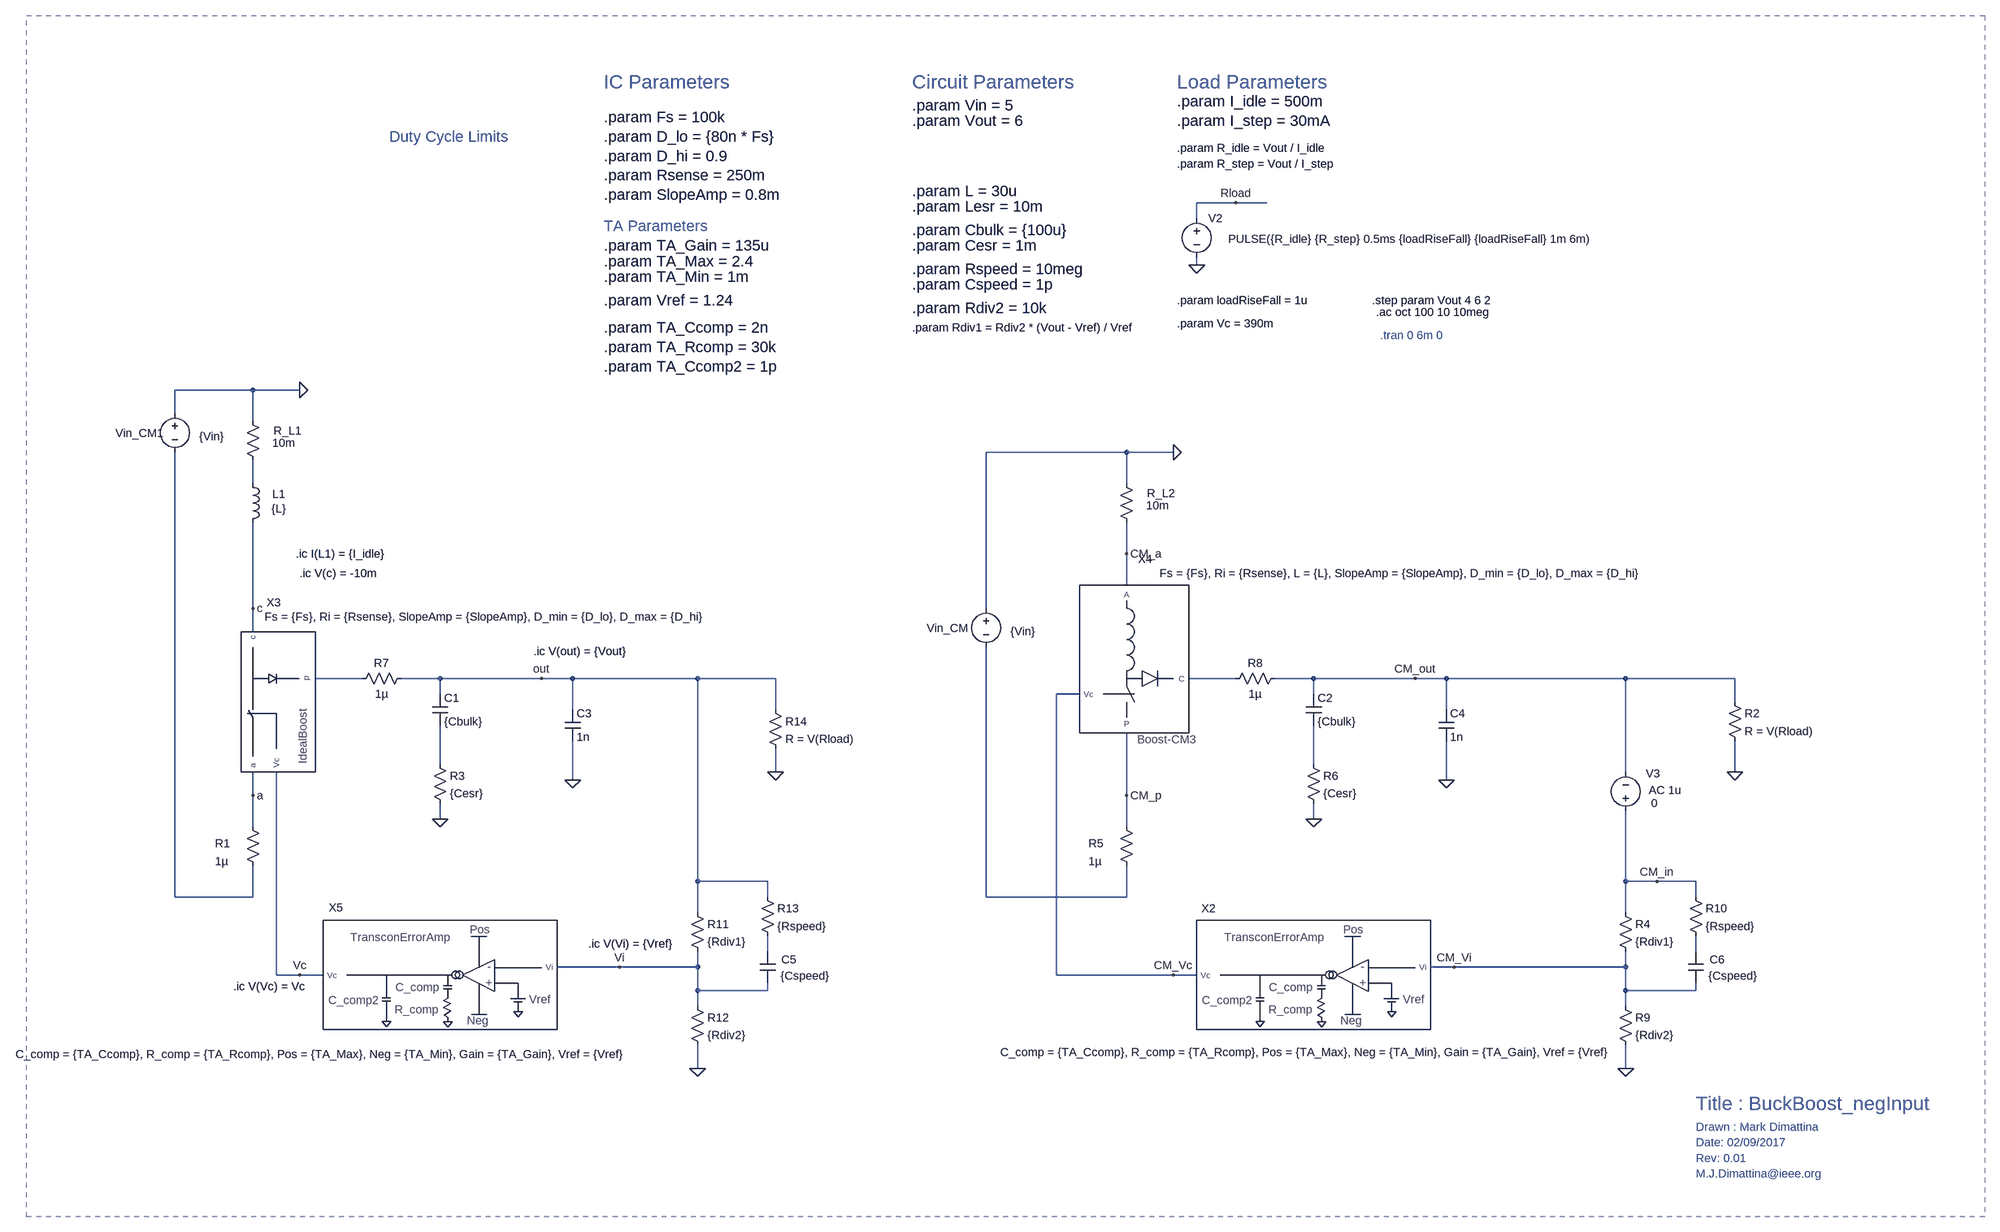
[diagram p0: schematic BuckBoost_negInput.asc]
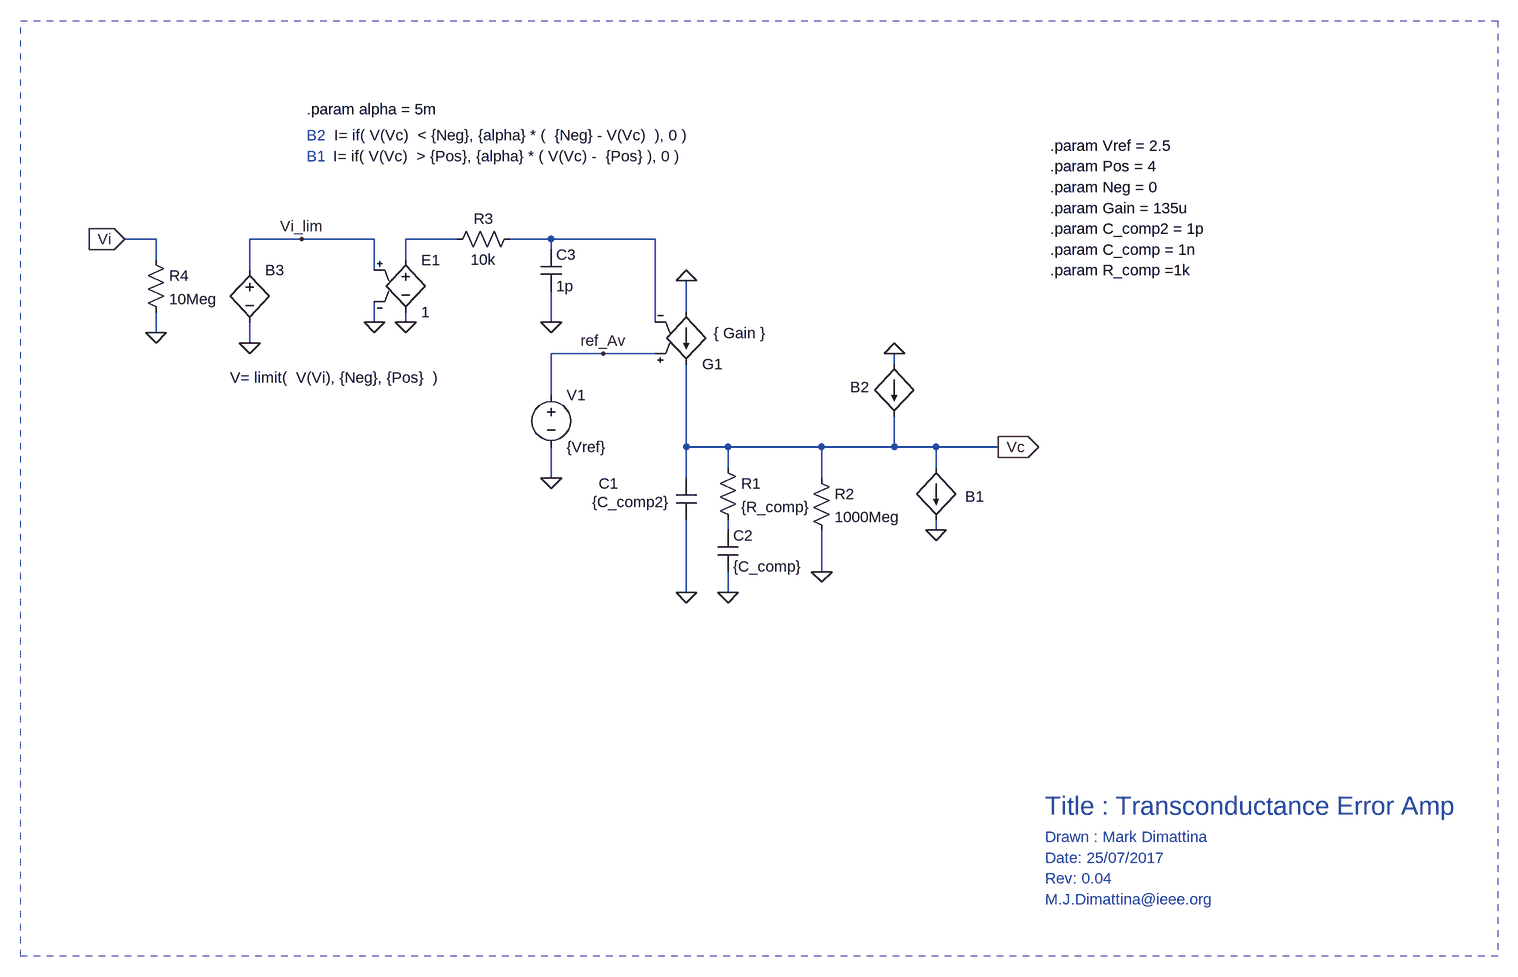
[diagram p1: sub-circuit transconerroramp.asc]
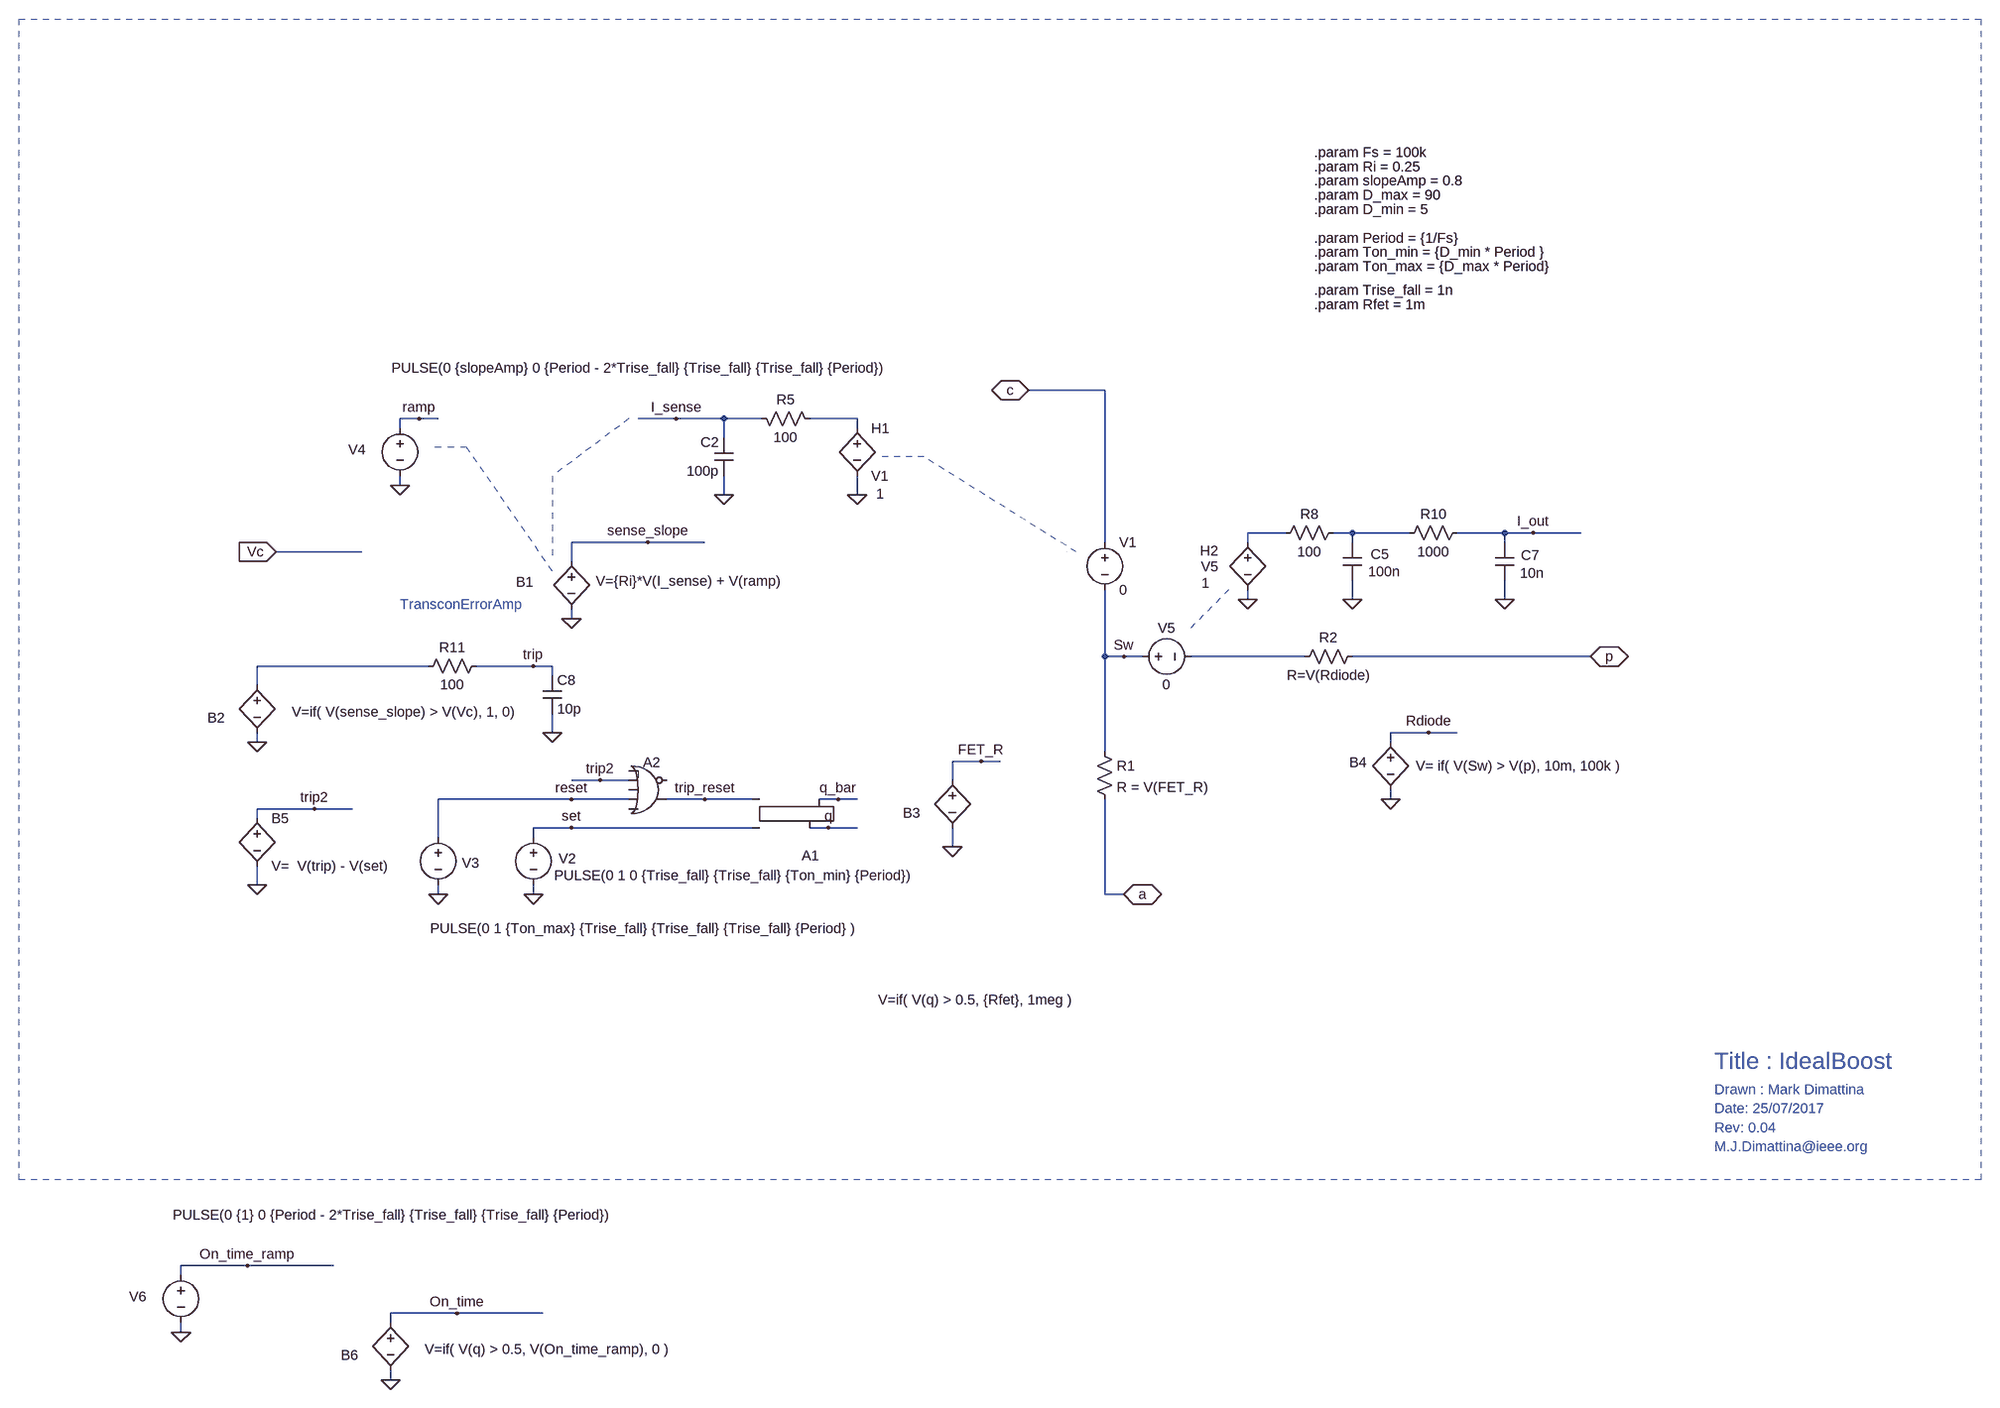
[diagram p2: sub-circuit idealboost.asc]
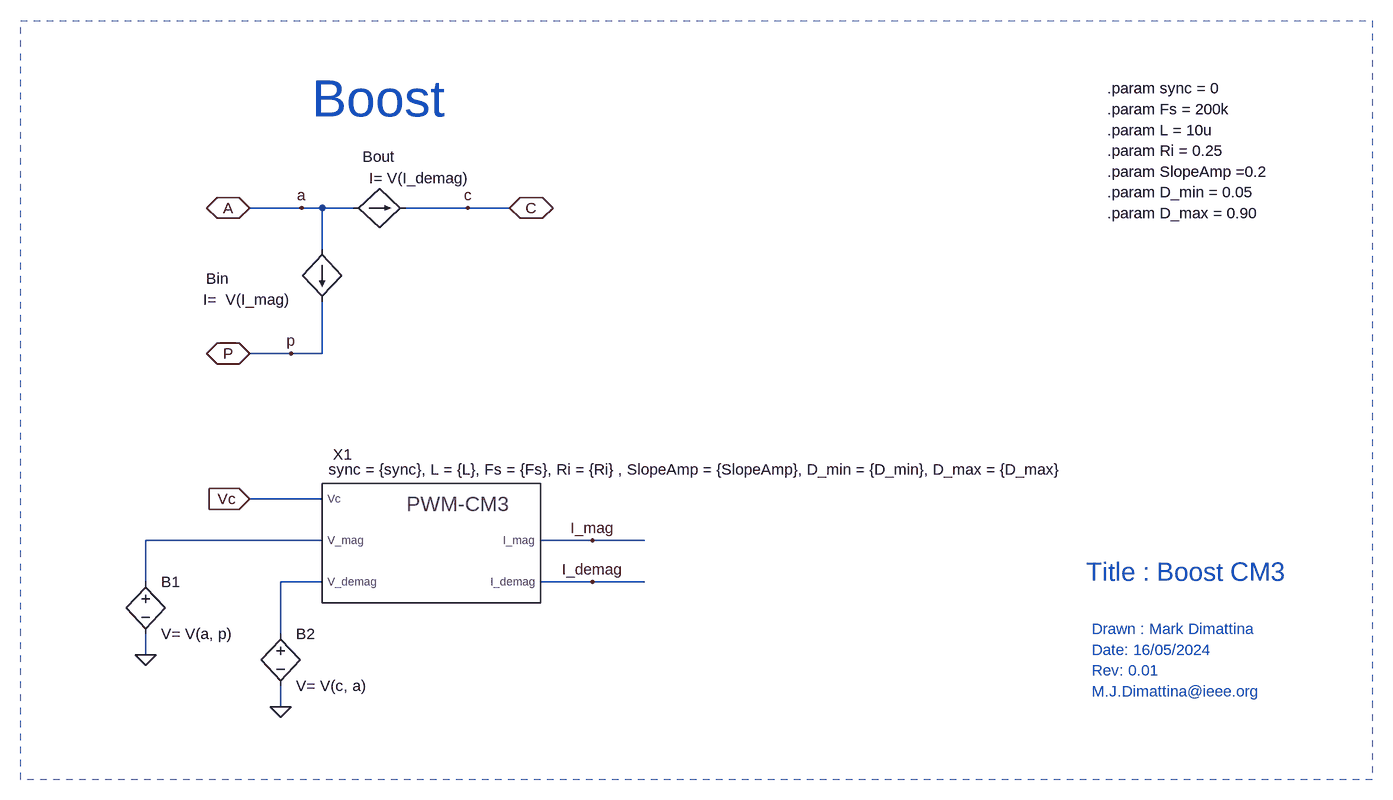
[diagram p3: sub-circuit boost_cm3.asc]
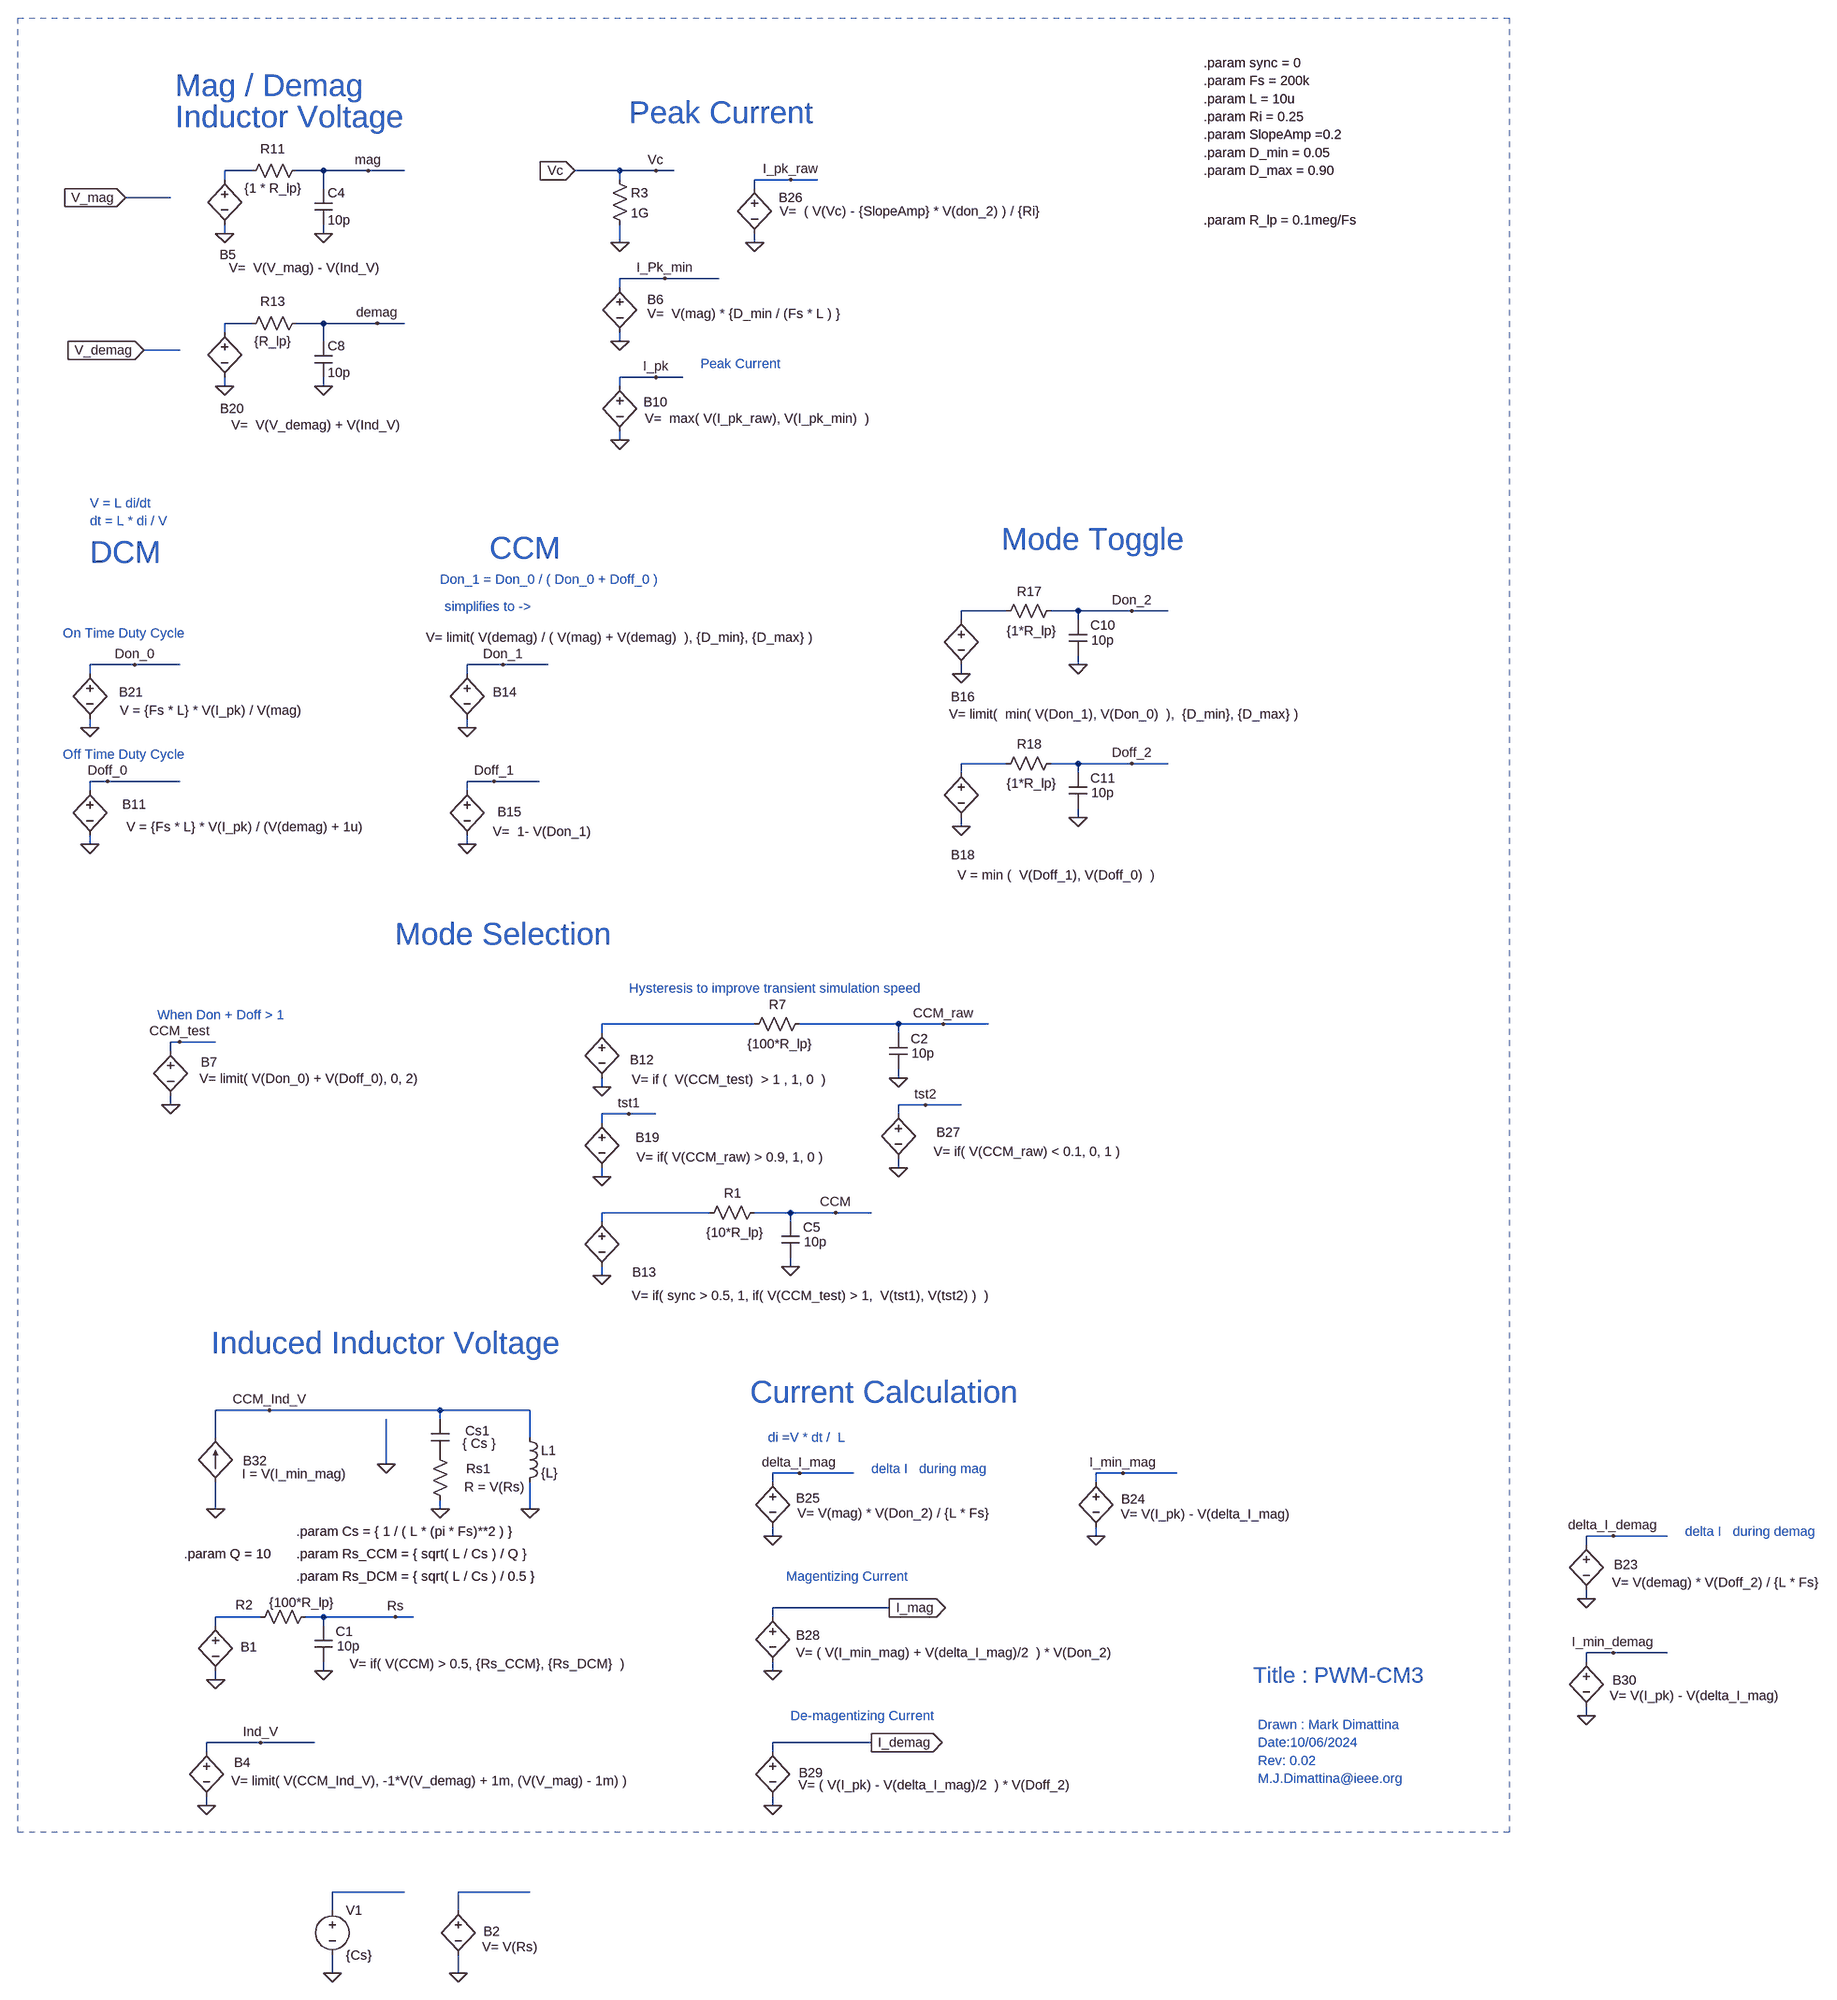
[diagram p4: sub-circuit pwm_cm3.asc]
BuckBoost_negInput.asc, the LTspice schematic file:
Version 4
SHEET 1 4164 4132
WIRE 784 -416 704 -416
WIRE 848 -416 784 -416
WIRE 704 -384 704 -416
WIRE 704 -288 704 -304
WIRE -1232 -32 -1392 -32
WIRE -1136 -32 -1232 -32
WIRE -1392 16 -1392 -32
WIRE -1232 32 -1232 -32
WIRE 560 96 272 96
WIRE 656 96 560 96
WIRE -1232 160 -1232 112
WIRE 560 160 560 96
WIRE 560 304 560 240
WIRE 560 368 560 304
WIRE -1232 416 -1232 240
WIRE 272 416 272 96
WIRE -1232 464 -1232 416
WIRE -1008 560 -1104 560
WIRE -848 560 -928 560
WIRE -640 560 -848 560
WIRE -576 560 -640 560
WIRE -320 560 -576 560
WIRE -160 560 -320 560
WIRE 784 560 688 560
WIRE 944 560 864 560
WIRE 1152 560 944 560
WIRE 1216 560 1152 560
WIRE 1584 560 1216 560
WIRE 1808 560 1584 560
WIRE -848 592 -848 560
WIRE 464 592 416 592
WIRE 944 592 944 560
WIRE 1808 608 1808 560
WIRE -576 624 -576 560
WIRE -160 624 -160 560
WIRE 1216 624 1216 560
WIRE -848 736 -848 656
WIRE 944 736 944 656
WIRE -160 752 -160 704
WIRE 1584 752 1584 560
WIRE 1808 752 1808 688
WIRE -576 768 -576 688
WIRE 1216 768 1216 688
WIRE -1232 800 -1232 752
WIRE 560 800 560 672
WIRE -848 848 -848 816
WIRE 944 848 944 816
WIRE -1232 864 -1232 800
WIRE 560 864 560 800
WIRE -320 976 -320 560
WIRE -176 976 -320 976
WIRE 1584 976 1584 832
WIRE 1648 976 1584 976
WIRE 1728 976 1648 976
WIRE -1392 1008 -1392 96
WIRE -1232 1008 -1232 944
WIRE -1232 1008 -1392 1008
WIRE -176 1008 -176 976
WIRE 272 1008 272 496
WIRE 560 1008 560 944
WIRE 560 1008 272 1008
WIRE 1728 1008 1728 976
WIRE -320 1040 -320 976
WIRE 1584 1040 1584 976
WIRE -176 1120 -176 1088
WIRE 1728 1120 1728 1088
WIRE -480 1152 -608 1152
WIRE -320 1152 -320 1120
WIRE -320 1152 -480 1152
WIRE 1232 1152 1184 1152
WIRE 1584 1152 1584 1120
WIRE 1584 1152 1232 1152
WIRE -1184 1168 -1184 752
WIRE -1136 1168 -1184 1168
WIRE -1088 1168 -1136 1168
WIRE 416 1168 416 592
WIRE 656 1168 416 1168
WIRE 704 1168 656 1168
WIRE -320 1200 -320 1152
WIRE -176 1200 -176 1184
WIRE -176 1200 -320 1200
WIRE 1584 1200 1584 1152
WIRE 1728 1200 1728 1184
WIRE 1728 1200 1584 1200
WIRE -320 1232 -320 1200
WIRE 1584 1232 1584 1200
WIRE -320 1360 -320 1312
WIRE 1584 1360 1584 1312
FLAG 1152 560 CM_out
FLAG 656 1168 CM_Vc
FLAG 944 848 0
FLAG 560 800 CM_p
FLAG 560 304 CM_a
FLAG 1216 768 0
FLAG 1584 1360 0
FLAG 1648 976 CM_in
FLAG 704 -288 0
FLAG 784 -416 Rload
FLAG 1808 752 0
FLAG 1232 1152 CM_Vi
FLAG -640 560 out
FLAG -1136 1168 Vc
FLAG -848 848 0
FLAG -1232 800 a
FLAG -1232 416 c
FLAG -576 768 0
FLAG -320 1360 0
FLAG -160 752 0
FLAG -480 1152 Vi
FLAG -1136 -32 0
FLAG 656 96 0
DATAFLAG 496 1168 ""
DATAFLAG 1712 560 ""
DATAFLAG 448 1008 ""
SYMBOL res 544 848 R0
WINDOW 0 -62 50 Left 2
WINDOW 3 -62 87 Left 2
SYMATTR InstName R5
SYMATTR Value 1µ
SYMBOL res 544 144 R0
WINDOW 0 58 36 Left 2
WINDOW 3 56 61 Left 2
SYMATTR InstName R_L2
SYMATTR Value 10m
SYMBOL voltage 272 400 R0
WINDOW 0 -122 57 Left 2
WINDOW 3 50 63 Left 2
SYMATTR InstName Vin_CM
SYMATTR Value {Vin}
SYMBOL cap 928 592 R0
SYMATTR InstName C2
SYMATTR Value {Cbulk}
SYMBOL res 928 720 R0
SYMATTR InstName R6
SYMATTR Value {Cesr}
SYMBOL res 768 576 R270
WINDOW 0 32 56 VTop 2
WINDOW 3 0 56 VBottom 2
SYMATTR InstName R8
SYMATTR Value 1µ
SYMBOL cap 1200 624 R0
SYMATTR InstName C4
SYMATTR Value 1n
SYMBOL res 1568 1024 R0
SYMATTR InstName R4
SYMATTR Value {Rdiv1}
SYMBOL res 1568 1216 R0
SYMATTR InstName R9
SYMATTR Value {Rdiv2}
SYMBOL res 1712 992 R0
SYMATTR InstName R10
SYMATTR Value {Rspeed}
SYMBOL cap 1712 1120 R0
WINDOW 0 44 17 Left 2
WINDOW 3 42 50 Left 2
SYMATTR InstName C6
SYMATTR Value {Cspeed}
SYMBOL voltage 1584 848 R180
WINDOW 0 -71 93 Left 2
WINDOW 3 -66 32 Left 2
WINDOW 123 -114 59 Left 2
WINDOW 39 0 0 Left 2
SYMATTR InstName V3
SYMATTR Value 0
SYMATTR Value2 AC 1u
SYMBOL voltage 704 -400 R0
WINDOW 3 65 58 Left 2
WINDOW 123 0 0 Left 2
WINDOW 39 0 0 Left 2
SYMATTR Value PULSE({R_idle} {R_step} 0.5ms {loadRiseFall} {loadRiseFall} 1m 6m)
SYMATTR InstName V2
SYMBOL res 1792 592 R0
SYMATTR InstName R2
SYMATTR Value R = V(Rload)
SYMBOL TransconErrorAmp 1088 1088 M0
WINDOW 0 345 -56 Left 2
WINDOW 39 -461 239 Left 2
SYMATTR InstName X2
SYMATTR SpiceLine C_comp = {TA_Ccomp}, R_comp = {TA_Rcomp}, Pos = {TA_Max}, Neg = {TA_Min}, Gain = {TA_Gain}, Vref = {Vref}
SYMBOL res -1248 848 R0
WINDOW 0 -62 50 Left 2
WINDOW 3 -62 87 Left 2
SYMATTR InstName R1
SYMATTR Value 1µ
SYMBOL ind -1248 144 R0
WINDOW 0 56 38 Left 2
WINDOW 3 54 68 Left 2
SYMATTR InstName L1
SYMATTR Value {L}
SYMBOL res -1248 16 R0
WINDOW 0 58 36 Left 2
WINDOW 3 56 61 Left 2
SYMATTR InstName R_L1
SYMATTR Value 10m
SYMBOL voltage -1392 0 R0
WINDOW 0 -122 57 Left 2
WINDOW 3 50 63 Left 2
SYMATTR InstName Vin_CM1
SYMATTR Value {Vin}
SYMBOL cap -864 592 R0
SYMATTR InstName C1
SYMATTR Value {Cbulk}
SYMBOL res -864 720 R0
SYMATTR InstName R3
SYMATTR Value {Cesr}
SYMBOL res -1024 576 R270
WINDOW 0 32 56 VTop 2
WINDOW 3 0 56 VBottom 2
SYMATTR InstName R7
SYMATTR Value 1µ
SYMBOL cap -592 624 R0
SYMATTR InstName C3
SYMATTR Value 1n
SYMBOL res -336 1024 R0
SYMATTR InstName R11
SYMATTR Value {Rdiv1}
SYMBOL res -336 1216 R0
SYMATTR InstName R12
SYMATTR Value {Rdiv2}
SYMBOL res -192 992 R0
SYMATTR InstName R13
SYMATTR Value {Rspeed}
SYMBOL cap -192 1120 R0
WINDOW 0 44 17 Left 2
WINDOW 3 42 50 Left 2
SYMATTR InstName C5
SYMATTR Value {Cspeed}
SYMBOL res -176 608 R0
SYMATTR InstName R14
SYMATTR Value R = V(Rload)
SYMBOL TransconErrorAmp -704 1088 M0
WINDOW 0 343 -58 Left 2
WINDOW 39 -233 243 Left 2
SYMATTR InstName X5
SYMATTR SpiceLine C_comp = {TA_Ccomp}, R_comp = {TA_Rcomp}, Pos = {TA_Max}, Neg = {TA_Min}, Gain = {TA_Gain}, Vref = {Vref}
SYMBOL IdealBoost -1200 656 R270
WINDOW 39 223 -8 VRight 2
WINDOW 0 236 11 VTop 2
SYMATTR SpiceLine Fs = {Fs}, Ri = {Rsense}, SlopeAmp = {SlopeAmp}, D_min = {D_lo}, D_max = {D_hi}
SYMATTR InstName X3
SYMBOL Boost_CM3 496 448 R0
WINDOW 0 102 -117 Bottom 2
WINDOW 39 625 -88 Bottom 2
SYMATTR InstName X4
SYMATTR SpiceLine Fs = {Fs}, Ri = {Rsense}, L = {L}, SlopeAmp = {SlopeAmp}, D_min = {D_lo}, D_max = {D_hi}
TEXT 1072 -192 Left 2 !.ac oct 100 10 10meg
TEXT 120 -440 Left 3 !.param L = 30u
TEXT -512 -592 Left 3 !.param Fs = 100k
TEXT -512 -552 Left 3 !.param D_lo = {80n * Fs}
TEXT -512 -512 Left 3 !.param D_hi = 0.9
TEXT -512 -432 Left 3 !.param SlopeAmp = 0.8m
TEXT -704 -552 Right 3 ;Duty Cycle Limits
TEXT -512 -664 Left 4 ;IC Parameters
TEXT 120 -584 Left 3 !.param Vout = 6
TEXT 120 -360 Left 3 !.param Cbulk = {100u}
TEXT 120 -328 Left 3 !.param Cesr = 1m
TEXT 120 -616 Left 3 !.param Vin = 5
TEXT 120 -408 Left 3 !.param Lesr = 10m
TEXT -512 -472 Left 3 !.param Rsense = 250m
TEXT 120 -200 Left 3 !.param Rdiv2 = 10k
TEXT 120 -160 Left 2 !.param Rdiv1 = Rdiv2 * (Vout - Vref) / Vref
TEXT -512 -216 Left 3 !.param Vref = 1.24
TEXT -512 -368 Left 3 ;TA Parameters
TEXT -512 -120 Left 3 !.param TA_Rcomp = 30k
TEXT -512 -160 Left 3 !.param TA_Ccomp = 2n
TEXT -512 -80 Left 3 !.param TA_Ccomp2 = 1p
TEXT -512 -328 Left 3 !.param TA_Gain = 135u
TEXT -512 -296 Left 3 !.param TA_Max = 2.4
TEXT -512 -264 Left 3 !.param TA_Min = 1m
TEXT 664 -584 Left 3 !.param I_step = 30mA
TEXT 664 -624 Left 3 !.param I_idle = 500m
TEXT 664 -528 Left 2 !.param R_idle = Vout / I_idle
TEXT 664 -216 Left 2 !.param loadRiseFall = 1u
TEXT 120 -280 Left 3 !.param Rspeed = 10meg
TEXT 120 -248 Left 3 !.param Cspeed = 1p
TEXT 664 -168 Left 2 !.param Vc = 390m
TEXT 120 -664 Left 4 ;Circuit Parameters
TEXT 664 -496 Left 2 !.param R_step = Vout / I_step
TEXT -656 504 Left 2 !.ic V(out) = {Vout}
TEXT -544 1104 Left 2 !.ic V(Vi) = {Vref}
TEXT 664 -664 Left 4 ;Load Parameters
TEXT -1272 1192 Left 2 !.ic V(Vc) = Vc
TEXT -1144 304 Left 2 !.ic I(L1) = {I_idle}
TEXT 1728 1480 Left 2 ;Drawn : Mark Dimattina
TEXT 1728 1432 Left 4 ;Title : BuckBoost_negInput
TEXT 1728 1544 Left 2 ;Rev: 0.01
TEXT 1728 1512 Left 2 ;Date: 02/09/2017
TEXT 1728 1576 Left 2 ;M.J.Dimattina@ieee.org
TEXT 1080 -144 Left 2 ;.tran 0 6m 0
TEXT -1136 344 Left 2 !.ic V(c) = -10m
TEXT 1064 -216 Left 2 !.step param Vout 4 6 2
RECTANGLE Normal 2320 1664 -1696 -800 2

transconerroramp.asc, the sub-circuit schematic file:
Version 4
SHEET 1 1752 1300
WIRE -560 192 -608 192
WIRE -336 192 -416 192
WIRE -224 192 -336 192
WIRE -96 192 -176 192
WIRE 48 192 -16 192
WIRE 208 192 48 192
WIRE 48 208 48 192
WIRE -560 224 -560 192
WIRE -176 224 -176 192
WIRE -416 240 -416 192
WIRE -224 240 -224 192
WIRE 256 304 256 256
WIRE -224 320 -224 288
WIRE -176 320 -176 304
WIRE 48 320 48 272
WIRE 208 320 208 192
WIRE -560 336 -560 304
WIRE -416 352 -416 320
WIRE 128 368 48 368
WIRE 208 368 128 368
WIRE 576 384 576 368
WIRE 48 432 48 368
WIRE 256 512 256 384
WIRE 320 512 256 512
WIRE 464 512 320 512
WIRE 576 512 576 464
WIRE 576 512 464 512
WIRE 640 512 576 512
WIRE 736 512 640 512
WIRE 320 544 320 512
WIRE 640 544 640 512
WIRE 48 560 48 512
WIRE 256 560 256 512
WIRE 464 560 464 512
WIRE 320 640 320 624
WIRE 640 640 640 624
WIRE 464 704 464 640
WIRE 256 736 256 624
WIRE 320 736 320 704
FLAG 48 560 0
FLAG 256 256 0
FLAG 256 736 0
FLAG 320 736 0
FLAG 128 368 ref_Av
FLAG -608 192 Vi
IOPIN -608 192 In
FLAG 736 512 Vc
IOPIN 736 512 Out
FLAG 640 640 0
FLAG 576 368 0
FLAG 464 704 0
FLAG -176 320 0
FLAG -224 320 0
FLAG 48 320 0
FLAG -416 352 0
FLAG -336 192 Vi_lim
FLAG -560 336 0
SYMBOL g 256 400 M180
WINDOW 3 42 63 Left 2
SYMATTR Value { Gain }
SYMATTR InstName G1
SYMBOL voltage 48 416 R0
SYMATTR InstName V1
SYMATTR Value {Vref}
SYMBOL cap 240 560 R0
WINDOW 3 -129 37 Left 2
WINDOW 0 -119 8 Left 2
SYMATTR Value {C_comp2}
SYMATTR InstName C1
SYMBOL cap 304 640 R0
SYMATTR InstName C2
SYMATTR Value {C_comp}
SYMBOL res 304 528 R0
SYMATTR InstName R1
SYMATTR Value {R_comp}
SYMBOL bi 640 544 R0
WINDOW 3 -927 -480 Left 2
WINDOW 0 45 44 Left 2
SYMATTR Value I= if( V(Vc)  > {Pos}, {alpha} * ( V(Vc) -  {Pos} ), 0 )
SYMATTR InstName B1
SYMBOL bi 576 384 R0
WINDOW 0 -68 36 Left 2
WINDOW 3 -862 -352 Left 2
SYMATTR InstName B2
SYMATTR Value I= if( V(Vc)  < {Neg}, {alpha} * (  {Neg} - V(Vc)  ), 0 )
SYMBOL res 448 544 R0
SYMATTR InstName R2
SYMATTR Value 1000Meg
SYMBOL cap 32 208 R0
SYMATTR InstName C3
SYMATTR Value 1p
SYMBOL res 0 176 R90
WINDOW 0 0 56 VBottom 2
WINDOW 3 32 56 VTop 2
SYMATTR InstName R3
SYMATTR Value 10k
SYMBOL e -176 208 R0
SYMATTR InstName E1
SYMATTR Value 1
SYMBOL bv -416 224 R0
WINDOW 3 -30 181 Left 2
SYMATTR Value V= limit(  V(Vi), {Neg}, {Pos}  )
SYMATTR InstName B3
SYMBOL res -576 208 R0
SYMATTR InstName R4
SYMATTR Value 10Meg
TEXT -328 -8 Left 2 !.param alpha = 5m
TEXT 816 240 Left 2 !.param R_comp =1k
TEXT 816 208 Left 2 !.param C_comp = 1n
TEXT 816 176 Left 2 !.param C_comp2 = 1p
TEXT -328 64 Left 2 ;B1
TEXT -328 32 Left 2 ;B2
TEXT 808 1112 Left 2 ;Drawn : Mark Dimattina
TEXT 808 1064 Left 4 ;Title : Transconductance Error Amp
TEXT 808 1176 Left 2 ;Rev: 0.04
TEXT 808 1144 Left 2 ;Date: 25/07/2017
TEXT 808 1208 Left 2 ;M.J.Dimattina@ieee.org
TEXT 816 80 Left 2 !.param Pos = 4
TEXT 816 112 Left 2 !.param Neg = 0
TEXT 816 48 Left 2 !.param Vref = 2.5
TEXT 816 144 Left 2 !.param Gain = 135u
RECTANGLE Normal 1504 1296 -768 -144 2

idealboost.asc, the sub-circuit schematic file:
Version 4
SHEET 1 972 680
WIRE -912 -1456 -1040 -1456
WIRE -2064 -1408 -2096 -1408
WIRE -2032 -1408 -2064 -1408
WIRE -1632 -1408 -1696 -1408
WIRE -1552 -1408 -1632 -1408
WIRE -1488 -1408 -1552 -1408
WIRE -1328 -1408 -1408 -1408
WIRE -2096 -1392 -2096 -1408
WIRE -1328 -1392 -1328 -1408
WIRE -1552 -1376 -1552 -1408
WIRE -2096 -1296 -2096 -1312
WIRE -1552 -1280 -1552 -1312
WIRE -1328 -1280 -1328 -1312
WIRE -608 -1216 -672 -1216
WIRE -496 -1216 -528 -1216
WIRE -400 -1216 -496 -1216
WIRE -240 -1216 -320 -1216
WIRE -192 -1216 -240 -1216
WIRE -112 -1216 -192 -1216
WIRE -1680 -1200 -1808 -1200
WIRE -1584 -1200 -1680 -1200
WIRE -912 -1200 -912 -1456
WIRE -672 -1200 -672 -1216
WIRE -496 -1200 -496 -1216
WIRE -240 -1200 -240 -1216
WIRE -2160 -1184 -2304 -1184
WIRE -1808 -1168 -1808 -1200
WIRE -672 -1104 -672 -1120
WIRE -496 -1104 -496 -1136
WIRE -240 -1104 -240 -1136
WIRE -1808 -1072 -1808 -1088
WIRE -912 -1008 -912 -1120
WIRE -880 -1008 -912 -1008
WIRE -848 -1008 -880 -1008
WIRE -576 -1008 -768 -1008
WIRE -96 -1008 -496 -1008
WIRE -2048 -992 -2336 -992
WIRE -1872 -992 -1968 -992
WIRE -1840 -992 -1872 -992
WIRE -1840 -976 -1840 -992
WIRE -2336 -960 -2336 -992
WIRE -1840 -880 -1840 -912
WIRE -368 -880 -432 -880
WIRE -320 -880 -368 -880
WIRE -2336 -864 -2336 -880
WIRE -432 -864 -432 -880
WIRE -912 -848 -912 -1008
WIRE -1120 -832 -1168 -832
WIRE -1088 -832 -1120 -832
WIRE -1760 -800 -1808 -800
WIRE -1712 -800 -1760 -800
WIRE -1168 -800 -1168 -832
WIRE -1808 -768 -2032 -768
WIRE -1712 -768 -1808 -768
WIRE -1584 -768 -1648 -768
WIRE -1504 -768 -1584 -768
WIRE -1360 -768 -1392 -768
WIRE -1328 -768 -1360 -768
WIRE -432 -768 -432 -784
WIRE -2240 -752 -2336 -752
WIRE -2176 -752 -2240 -752
WIRE -2336 -736 -2336 -752
WIRE -1808 -720 -1872 -720
WIRE -1504 -720 -1808 -720
WIRE -1376 -720 -1408 -720
WIRE -1328 -720 -1376 -720
WIRE -2032 -704 -2032 -768
WIRE -1872 -704 -1872 -720
WIRE -1168 -688 -1168 -720
WIRE -2336 -624 -2336 -656
WIRE -2032 -608 -2032 -624
WIRE -1872 -608 -1872 -624
WIRE -912 -608 -912 -768
WIRE -880 -608 -912 -608
WIRE -2352 16 -2464 16
WIRE -2208 16 -2352 16
WIRE -2464 32 -2464 16
WIRE -2000 96 -2112 96
WIRE -1856 96 -2000 96
WIRE -2112 112 -2112 96
WIRE -2464 128 -2464 112
WIRE -2112 208 -2112 192
FLAG -1040 -1456 c
IOPIN -1040 -1456 BiDir
FLAG -1328 -1280 0
FLAG -1632 -1408 I_sense
FLAG -1552 -1280 0
FLAG -1872 -608 0
FLAG -2032 -608 0
FLAG -1808 -768 reset
FLAG -1808 -720 set
FLAG -1584 -768 trip_reset
FLAG -96 -1008 p
IOPIN -96 -1008 BiDir
FLAG -1376 -720 q
FLAG -672 -1104 0
FLAG -496 -1104 0
FLAG -880 -608 a
IOPIN -880 -608 BiDir
FLAG -880 -1008 Sw
FLAG -1680 -1200 sense_slope
FLAG -192 -1216 I_out
FLAG -240 -1104 0
FLAG -2304 -1184 Vc
IOPIN -2304 -1184 In
FLAG -1360 -768 q_bar
FLAG -2336 -864 0
FLAG -1840 -880 0
FLAG -1872 -992 trip
FLAG -1760 -800 trip2
FLAG -1168 -688 0
FLAG -2096 -1296 0
FLAG -2064 -1408 ramp
FLAG -1808 -1072 0
FLAG -432 -768 0
FLAG -368 -880 Rdiode
FLAG -2336 -624 0
FLAG -2240 -752 trip2
FLAG -2464 128 0
FLAG -2352 16 On_time_ramp
FLAG -2112 208 0
FLAG -2000 96 On_time
FLAG -1120 -832 FET_R
SYMBOL h -1328 -1408 R0
WINDOW 123 32 126 Left 2
SYMATTR Value2 1
SYMATTR InstName H1
SYMATTR Value V1
SYMBOL voltage -912 -1216 R0
SYMATTR InstName V1
SYMATTR Value 0
SYMBOL res -1504 -1424 M90
WINDOW 0 0 56 VBottom 2
WINDOW 3 32 56 VTop 2
SYMATTR InstName R5
SYMATTR Value 100
SYMBOL cap -1536 -1376 M0
SYMATTR InstName C2
SYMATTR Value 100p
SYMBOL srflop -1456 -672 M180
WINDOW 0 35 1 Left 2
SYMATTR InstName A1
SYMBOL voltage -1872 -720 M0
WINDOW 3 -35 80 Right 2
WINDOW 123 0 0 Left 2
WINDOW 39 0 0 Left 2
WINDOW 0 -72 52 Left 2
SYMATTR Value PULSE(0 1 0 {Trise_fall} {Trise_fall} {Ton_min} {Period})
SYMATTR InstName V2
SYMBOL voltage -2032 -720 R0
WINDOW 123 0 0 Left 2
WINDOW 39 0 0 Left 2
WINDOW 3 -13 169 Left 2
WINDOW 0 40 59 Left 2
SYMATTR Value PULSE(0 1 {Ton_max} {Trise_fall} {Trise_fall} {Trise_fall} {Period} )
SYMATTR InstName V3
SYMBOL h -672 -1216 R0
WINDOW 123 -77 84 Left 2
WINDOW 0 -80 30 Left 2
WINDOW 3 -78 57 Left 2
SYMATTR Value2 1
SYMATTR InstName H2
SYMATTR Value V5
SYMBOL res -512 -1232 R90
WINDOW 0 0 56 VBottom 2
WINDOW 3 32 56 VTop 2
SYMATTR InstName R8
SYMATTR Value 100
SYMBOL cap -512 -1200 R0
WINDOW 0 47 20 Left 2
WINDOW 3 43 49 Left 2
SYMATTR InstName C5
SYMATTR Value 100n
SYMBOL voltage -2096 -1408 R0
WINDOW 3 -14 -85 Left 2
WINDOW 123 0 0 Left 2
WINDOW 39 0 0 Left 2
WINDOW 0 -87 52 Left 2
SYMATTR Value PULSE(0 {slopeAmp} 0 {Period - 2*Trise_fall} {Trise_fall} {Trise_fall} {Period})
SYMATTR InstName V4
SYMBOL bv -1808 -1184 R0
WINDOW 0 -93 51 Left 2
WINDOW 3 41 49 Left 2
SYMATTR InstName B1
SYMATTR Value V={Ri}*V(I_sense) + V(ramp)
SYMBOL voltage -864 -1008 R270
WINDOW 0 32 56 VTop 2
WINDOW 3 -32 56 VBottom 2
SYMATTR InstName V5
SYMATTR Value 0
SYMBOL res -304 -1232 R90
WINDOW 0 0 56 VBottom 2
WINDOW 3 32 56 VTop 2
SYMATTR InstName R10
SYMATTR Value 1000
SYMBOL cap -256 -1200 R0
WINDOW 0 43 22 Left 2
WINDOW 3 42 52 Left 2
SYMATTR InstName C7
SYMATTR Value 10n
SYMBOL Digital\\or -1680 -720 M180
WINDOW 0 -8 110 Left 2
SYMATTR InstName A2
SYMBOL bv -2336 -976 R0
WINDOW 0 -83 71 Left 2
WINDOW 3 58 61 Left 2
SYMATTR InstName B2
SYMATTR Value V=if( V(sense_slope) > V(Vc), 1, 0)
SYMBOL res -1952 -1008 R90
WINDOW 0 0 56 VBottom 2
WINDOW 3 32 56 VTop 2
SYMATTR InstName R11
SYMATTR Value 100
SYMBOL cap -1856 -976 R0
SYMATTR InstName C8
SYMATTR Value 10p
SYMBOL bv -1168 -816 R0
WINDOW 0 -83 71 Left 2
WINDOW 3 -125 385 Left 2
SYMATTR InstName B3
SYMATTR Value V=if( V(q) > 0.5, {Rfet}, 1meg )
SYMBOL res -592 -992 R270
WINDOW 0 32 56 VTop 2
WINDOW 3 0 56 VBottom 2
SYMATTR InstName R2
SYMATTR Value R=V(Rdiode)
SYMBOL bv -432 -880 R0
WINDOW 0 -69 50 Left 2
WINDOW 3 43 56 Left 2
SYMATTR InstName B4
SYMATTR Value V= if( V(Sw) > V(p), 10m, 100k )
SYMBOL bv -2336 -752 R0
SYMATTR InstName B5
SYMATTR Value V=  V(trip) - V(set)
SYMBOL voltage -2464 16 R0
WINDOW 3 -14 -85 Left 2
WINDOW 123 0 0 Left 2
WINDOW 39 0 0 Left 2
WINDOW 0 -87 52 Left 2
SYMATTR Value PULSE(0 {1} 0 {Period - 2*Trise_fall} {Trise_fall} {Trise_fall} {Period})
SYMATTR InstName V6
SYMBOL bv -2112 96 R0
WINDOW 0 -83 71 Left 2
WINDOW 3 58 61 Left 2
SYMATTR InstName B6
SYMATTR Value V=if( V(q) > 0.5, V(On_time_ramp), 0 )
SYMBOL res -928 -864 R0
SYMATTR InstName R1
SYMATTR Value R = V(FET_R)
TEXT -2096 -1096 Left 2 ;TransconErrorAmp
TEXT -560 -1712 Left 2 !.param Period = {1/Fs}
TEXT -560 -1624 Left 2 !.param Trise_fall = 1n
TEXT -560 -1688 Left 2 !.param Ton_min = {D_min * Period }
TEXT -560 -1664 Left 2 !.param Ton_max = {D_max * Period}
TEXT -560 -1600 Left 2 !.param Rfet = 1m
TEXT -560 -1856 Left 2 !.param Fs = 100k
TEXT -560 -1784 Left 2 !.param D_max = 90
TEXT -560 -1760 Left 2 !.param D_min = 5
TEXT -560 -1808 Left 2 !.param slopeAmp = 0.8
TEXT -560 -1832 Left 2 !.param Ri = 0.25
TEXT 112 -280 Left 2 ;Drawn : Mark Dimattina
TEXT 112 -328 Left 4 ;Title : IdealBoost
TEXT 112 -216 Left 2 ;Rev: 0.04
TEXT 112 -248 Left 2 ;Date: 25/07/2017
TEXT 112 -184 Left 2 ;M.J.Dimattina@ieee.org
LINE Normal -1216 -1344 -1296 -1344 2
LINE Normal -960 -1184 -1216 -1344 2
LINE Normal -976 -1184 -976 -1184 2
LINE Normal -704 -1120 -768 -1056 2
LINE Normal -1840 -1312 -1840 -1168 2
LINE Normal -1712 -1408 -1840 -1312 2
LINE Normal -1984 -1360 -2048 -1360 2
LINE Normal -1840 -1152 -1984 -1360 2
RECTANGLE Normal 560 -128 -2736 -2080 2

boost_cm3.asc, the sub-circuit schematic file:
Version 4
SHEET 1 3748 852
WIRE -1872 -2448 -1952 -2448
WIRE -1840 -2448 -1872 -2448
WIRE -1792 -2448 -1840 -2448
WIRE -1616 -2448 -1712 -2448
WIRE -1552 -2448 -1616 -2448
WIRE -1840 -2384 -1840 -2448
WIRE -1888 -2224 -1952 -2224
WIRE -1840 -2224 -1840 -2304
WIRE -1840 -2224 -1888 -2224
WIRE -1840 -2000 -1952 -2000
WIRE -1840 -1936 -2112 -1936
WIRE -1424 -1936 -1504 -1936
WIRE -1344 -1936 -1424 -1936
WIRE -2112 -1872 -2112 -1936
WIRE -1840 -1872 -1904 -1872
WIRE -1424 -1872 -1504 -1872
WIRE -1344 -1872 -1424 -1872
WIRE -1904 -1792 -1904 -1872
WIRE -2112 -1760 -2112 -1792
WIRE -1904 -1680 -1904 -1712
FLAG -1952 -2448 A
IOPIN -1952 -2448 BiDir
FLAG -1552 -2448 C
IOPIN -1552 -2448 BiDir
FLAG -1952 -2224 P
IOPIN -1952 -2224 BiDir
FLAG -1616 -2448 c
FLAG -1872 -2448 a
FLAG -1952 -2000 Vc
IOPIN -1952 -2000 In
FLAG -2112 -1760 0
FLAG -1904 -1680 0
FLAG -1424 -1936 I_mag
FLAG -1424 -1872 I_demag
FLAG -1888 -2224 p
SYMBOL bi -1840 -2384 R0
WINDOW 0 -179 45 Left 2
WINDOW 3 -183 77 Left 2
SYMATTR InstName Bin
SYMATTR Value I=  V(I_mag)
SYMBOL bi -1792 -2448 R270
WINDOW 0 63 39 VTop 2
WINDOW 3 61 101 VBottom 2
SYMATTR InstName Bout
SYMATTR Value I= V(I_demag)
SYMBOL PWM_CM3 -1680 -1936 R0
WINDOW 0 -129 -117 Bottom 2
WINDOW 39 -150 -109 Left 2
SYMATTR InstName X1
SYMATTR SpiceLine sync = {sync}, L = {L}, Fs = {Fs}, Ri = {Ri} , SlopeAmp = {SlopeAmp}, D_min = {D_min}, D_max = {D_max}
SYMBOL bv -2112 -1888 R0
SYMATTR InstName B1
SYMATTR Value V= V(a, p)
SYMBOL bv -1904 -1808 R0
SYMATTR InstName B2
SYMATTR Value V= V(c, a)
TEXT -632 -2568 Left 2 !.param L = 10u
TEXT -632 -2600 Left 2 !.param Fs = 200k
TEXT -632 -2472 Left 2 !.param D_min = 0.05
TEXT -632 -2440 Left 2 !.param D_max = 0.90
TEXT -632 -2504 Left 2 !.param SlopeAmp =0.2
TEXT -632 -2536 Left 2 !.param Ri = 0.25
TEXT -632 -2632 Left 2 !.param sync = 0
TEXT -656 -1800 Left 2 ;Drawn : Mark Dimattina
TEXT -664 -1888 Left 4 ;Title : Boost CM3
TEXT -656 -1736 Left 2 ;Rev: 0.01
TEXT -656 -1768 Left 2 ;Date: 16/05/2024
TEXT -656 -1704 Left 2 ;M.J.Dimattina@ieee.org
TEXT -1856 -2616 Left 6 ;Boost
RECTANGLE Normal -224 -1568 -2304 -2736 2

pwm_cm3.asc, the sub-circuit schematic file:
Version 4
SHEET 1 4220 852
WIRE -1600 -4432 -1648 -4432
WIRE -1472 -4432 -1520 -4432
WIRE -1392 -4432 -1472 -4432
WIRE -1328 -4432 -1392 -4432
WIRE -944 -4432 -1024 -4432
WIRE -880 -4432 -944 -4432
WIRE -848 -4432 -880 -4432
WIRE -1648 -4416 -1648 -4432
WIRE -944 -4416 -944 -4432
WIRE -640 -4416 -704 -4416
WIRE -592 -4416 -640 -4416
WIRE -1472 -4400 -1472 -4432
WIRE -704 -4400 -704 -4416
WIRE -1744 -4384 -1824 -4384
WIRE -1648 -4320 -1648 -4336
WIRE -1472 -4320 -1472 -4336
WIRE -944 -4304 -944 -4336
WIRE -704 -4304 -704 -4320
WIRE -864 -4240 -944 -4240
WIRE -768 -4240 -864 -4240
WIRE -944 -4224 -944 -4240
WIRE -1600 -4160 -1648 -4160
WIRE -1472 -4160 -1520 -4160
WIRE -1376 -4160 -1472 -4160
WIRE -1328 -4160 -1376 -4160
WIRE -1648 -4144 -1648 -4160
WIRE -1472 -4128 -1472 -4160
WIRE -944 -4128 -944 -4144
WIRE -1728 -4112 -1792 -4112
WIRE -880 -4064 -944 -4064
WIRE -832 -4064 -880 -4064
WIRE -1648 -4048 -1648 -4064
WIRE -1472 -4048 -1472 -4064
WIRE -944 -4048 -944 -4064
WIRE -944 -3952 -944 -3968
WIRE -256 -3648 -336 -3648
WIRE -128 -3648 -176 -3648
WIRE -32 -3648 -128 -3648
WIRE 32 -3648 -32 -3648
WIRE -336 -3632 -336 -3648
WIRE -128 -3632 -128 -3648
WIRE -1808 -3552 -1888 -3552
WIRE -1728 -3552 -1808 -3552
WIRE -1152 -3552 -1216 -3552
WIRE -1072 -3552 -1152 -3552
WIRE -128 -3552 -128 -3568
WIRE -1888 -3536 -1888 -3552
WIRE -1216 -3536 -1216 -3552
WIRE -336 -3536 -336 -3552
WIRE -1888 -3440 -1888 -3456
WIRE -1216 -3440 -1216 -3456
WIRE -256 -3376 -336 -3376
WIRE -128 -3376 -176 -3376
WIRE -32 -3376 -128 -3376
WIRE 32 -3376 -32 -3376
WIRE -336 -3360 -336 -3376
WIRE -128 -3360 -128 -3376
WIRE -1856 -3344 -1888 -3344
WIRE -1728 -3344 -1856 -3344
WIRE -1168 -3344 -1216 -3344
WIRE -1088 -3344 -1168 -3344
WIRE -1888 -3328 -1888 -3344
WIRE -1216 -3328 -1216 -3344
WIRE -128 -3280 -128 -3296
WIRE -336 -3264 -336 -3280
WIRE -1888 -3232 -1888 -3248
WIRE -1216 -3232 -1216 -3248
WIRE -704 -2912 -976 -2912
WIRE -448 -2912 -624 -2912
WIRE -368 -2912 -448 -2912
WIRE -288 -2912 -368 -2912
WIRE -976 -2896 -976 -2912
WIRE -448 -2896 -448 -2912
WIRE -1728 -2880 -1744 -2880
WIRE -1664 -2880 -1728 -2880
WIRE -1744 -2864 -1744 -2880
WIRE -448 -2816 -448 -2832
WIRE -976 -2800 -976 -2816
WIRE -1744 -2768 -1744 -2784
WIRE -400 -2768 -448 -2768
WIRE -336 -2768 -400 -2768
WIRE -928 -2752 -976 -2752
WIRE -880 -2752 -928 -2752
WIRE -448 -2752 -448 -2768
WIRE -976 -2736 -976 -2752
WIRE -448 -2656 -448 -2672
WIRE -976 -2640 -976 -2656
WIRE -784 -2576 -976 -2576
WIRE -640 -2576 -704 -2576
WIRE -560 -2576 -640 -2576
WIRE -496 -2576 -560 -2576
WIRE -976 -2560 -976 -2576
WIRE -640 -2560 -640 -2576
WIRE -640 -2480 -640 -2496
WIRE -976 -2464 -976 -2480
WIRE -1568 -2224 -1664 -2224
WIRE -1264 -2224 -1568 -2224
WIRE -1104 -2224 -1264 -2224
WIRE -1264 -2208 -1264 -2224
WIRE -1664 -2176 -1664 -2224
WIRE -1104 -2176 -1104 -2224
WIRE -1360 -2128 -1360 -2208
WIRE -624 -2112 -672 -2112
WIRE -528 -2112 -624 -2112
WIRE -48 -2112 -96 -2112
WIRE 48 -2112 -48 -2112
WIRE -672 -2096 -672 -2112
WIRE -96 -2096 -96 -2112
WIRE -1664 -2048 -1664 -2096
WIRE -1264 -2048 -1264 -2064
WIRE -1104 -2048 -1104 -2096
WIRE -672 -2000 -672 -2016
WIRE -96 -2000 -96 -2016
WIRE 832 -2000 784 -2000
WIRE 928 -2000 832 -2000
WIRE 784 -1984 784 -2000
WIRE 784 -1888 784 -1904
WIRE -464 -1872 -672 -1872
WIRE -1584 -1856 -1664 -1856
WIRE -1472 -1856 -1504 -1856
WIRE -1344 -1856 -1472 -1856
WIRE -1312 -1856 -1344 -1856
WIRE -672 -1856 -672 -1872
WIRE -1664 -1840 -1664 -1856
WIRE -1472 -1840 -1472 -1856
WIRE 832 -1792 784 -1792
WIRE 928 -1792 832 -1792
WIRE 784 -1776 784 -1792
WIRE -1472 -1760 -1472 -1776
WIRE -672 -1760 -672 -1776
WIRE -1664 -1744 -1664 -1760
WIRE 784 -1680 784 -1696
WIRE -1584 -1632 -1680 -1632
WIRE -1488 -1632 -1584 -1632
WIRE -496 -1632 -672 -1632
WIRE -1680 -1616 -1680 -1632
WIRE -672 -1616 -672 -1632
WIRE -1680 -1520 -1680 -1536
WIRE -672 -1520 -672 -1536
WIRE -1328 -1312 -1456 -1312
WIRE -1104 -1312 -1232 -1312
WIRE -1456 -1280 -1456 -1312
WIRE -1232 -1280 -1232 -1312
WIRE -1456 -1168 -1456 -1200
WIRE -1232 -1168 -1232 -1200
FLAG -944 -4304 0
FLAG -1024 -4432 Vc
IOPIN -1024 -4432 In
FLAG -880 -4432 Vc
FLAG -880 -4064 I_pk
FLAG -944 -4128 0
FLAG -864 -4240 I_Pk_min
FLAG -944 -3952 0
FLAG -704 -4304 0
FLAG -640 -4416 I_pk_raw
FLAG -1888 -3440 0
FLAG -1808 -3552 Don_0
FLAG -1888 -3232 0
FLAG -976 -2800 0
FLAG -560 -2576 CCM
FLAG -448 -2816 0
FLAG -1216 -3440 0
FLAG -1216 -3232 0
FLAG -1168 -3344 Doff_1
FLAG -336 -3536 0
FLAG -32 -3648 Don_2
FLAG -128 -3552 0
FLAG -336 -3264 0
FLAG -32 -3376 Doff_2
FLAG -128 -3280 0
FLAG 784 -1888 0
FLAG 832 -2000 delta_I_demag
FLAG -96 -2000 0
FLAG -48 -2112 I_min_mag
FLAG -672 -2000 0
FLAG -624 -2112 delta_I_mag
FLAG -672 -1760 0
FLAG -464 -1872 I_mag
IOPIN -464 -1872 Out
FLAG -672 -1520 0
FLAG -496 -1632 I_demag
IOPIN -496 -1632 Out
FLAG 784 -1680 0
FLAG 832 -1792 I_min_demag
FLAG -1856 -3344 Doff_0
FLAG -1568 -2224 CCM_Ind_V
FLAG -1648 -4320 0
FLAG -1392 -4432 mag
FLAG -1472 -4320 0
FLAG -1456 -1168 0
FLAG -368 -2912 CCM_raw
FLAG -1152 -3552 Don_1
FLAG -1680 -1520 0
FLAG -1584 -1632 Ind_V
FLAG -1648 -4048 0
FLAG -1376 -4160 demag
FLAG -1472 -4048 0
FLAG -1744 -2768 0
FLAG -1728 -2880 CCM_test
FLAG -976 -2464 0
FLAG -928 -2752 tst1
FLAG -976 -2640 0
FLAG -400 -2768 tst2
FLAG -448 -2656 0
FLAG -640 -2480 0
FLAG -1664 -2048 0
FLAG -1264 -2048 0
FLAG -1104 -2048 0
FLAG -1824 -4384 V_mag
IOPIN -1824 -4384 In
FLAG -1792 -4112 V_demag
IOPIN -1792 -4112 In
FLAG -1232 -1168 0
FLAG -1360 -2128 0
FLAG -1664 -1744 0
FLAG -1344 -1856 Rs
FLAG -1472 -1760 0
DATAFLAG -1376 -1312 ""
DATAFLAG -1152 -1312 ""
SYMBOL res -960 -4432 R0
SYMATTR InstName R3
SYMATTR Value 1G
SYMBOL bv -944 -4240 R0
WINDOW 3 49 63 Left 2
WINDOW 0 49 38 Left 2
SYMATTR Value V=  V(mag) * {D_min / (Fs * L ) }
SYMATTR InstName B6
SYMBOL bv -944 -4064 R0
WINDOW 3 45 73 Left 2
WINDOW 0 42 44 Left 2
SYMATTR Value V=  max( V(I_pk_raw), V(I_pk_min)  )
SYMATTR InstName B10
SYMBOL bv -704 -4416 R0
WINDOW 3 45 56 Left 2
WINDOW 0 43 32 Left 2
SYMATTR Value V=  ( V(Vc) - {SlopeAmp} * V(don_2) ) / {Ri}
SYMATTR InstName B26
SYMBOL bv -1888 -3552 R0
WINDOW 3 54 81 Left 2
WINDOW 0 52 49 Left 2
SYMATTR Value V = {Fs * L} * V(I_pk) / V(mag)
SYMATTR InstName B21
SYMBOL bv -1888 -3344 R0
WINDOW 3 65 81 Left 2
WINDOW 0 58 41 Left 2
SYMATTR Value V = {Fs * L} * V(I_pk) / (V(demag) + 1u)
SYMATTR InstName B11
SYMBOL bv -976 -2912 R0
WINDOW 3 53 99 Left 2
WINDOW 0 50 64 Left 2
SYMATTR Value V= if (  V(CCM_test)  > 1 , 1, 0  )
SYMATTR InstName B12
SYMBOL res -608 -2928 R90
WINDOW 0 -3 55 VBottom 2
WINDOW 3 36 51 VTop 2
SYMATTR InstName R7
SYMATTR Value {100*R_lp}
SYMBOL cap -464 -2896 R0
WINDOW 0 38 10 Left 2
WINDOW 3 40 36 Left 2
SYMATTR InstName C2
SYMATTR Value 10p
SYMBOL bv -1216 -3552 R0
WINDOW 3 -73 -49 Left 2
WINDOW 0 46 49 Left 2
SYMATTR Value V= limit( V(demag) / ( V(mag) + V(demag)  ), {D_min}, {D_max} )
SYMATTR InstName B14
SYMBOL bv -1216 -3344 R0
WINDOW 3 221 89 Right 2
WINDOW 0 54 54 Left 2
SYMATTR Value V=  1- V(Don_1)
SYMATTR InstName B15
SYMBOL bv -336 -3648 R0
WINDOW 3 -22 184 Left 2
WINDOW 0 -18 153 Left 2
SYMATTR Value V= limit(  min( V(Don_1), V(Don_0)  ),  {D_min}, {D_max} )
SYMATTR InstName B16
SYMBOL res -160 -3664 R90
WINDOW 0 -3 55 VBottom 2
WINDOW 3 36 51 VTop 2
SYMATTR InstName R17
SYMATTR Value {1*R_lp}
SYMBOL cap -144 -3632 R0
WINDOW 0 38 10 Left 2
WINDOW 3 40 36 Left 2
SYMATTR InstName C10
SYMATTR Value 10p
SYMBOL bv -336 -3376 R0
WINDOW 3 -7 199 Left 2
WINDOW 0 -18 163 Left 2
SYMATTR Value V = min (  V(Doff_1), V(Doff_0)  )
SYMATTR InstName B18
SYMBOL res -160 -3392 R90
WINDOW 0 -3 55 VBottom 2
WINDOW 3 36 51 VTop 2
SYMATTR InstName R18
SYMATTR Value {1*R_lp}
SYMBOL cap -144 -3360 R0
WINDOW 0 38 10 Left 2
WINDOW 3 40 36 Left 2
SYMATTR InstName C11
SYMATTR Value 10p
SYMBOL bv 784 -2000 R0
WINDOW 3 46 83 Left 2
WINDOW 0 49 51 Left 2
SYMATTR Value V= V(demag) * V(Doff_2) / {L * Fs}
SYMATTR InstName B23
SYMBOL bv -96 -2112 R0
WINDOW 3 44 73 Left 2
WINDOW 0 45 46 Left 2
SYMATTR Value V= V(I_pk) - V(delta_I_mag)
SYMATTR InstName B24
SYMBOL bv -672 -2112 R0
WINDOW 3 44 71 Left 2
WINDOW 0 42 45 Left 2
SYMATTR Value V= V(mag) * V(Don_2) / {L * Fs}
SYMATTR InstName B25
SYMBOL bv -672 -1872 R0
WINDOW 3 42 80 Left 2
WINDOW 0 42 49 Left 2
SYMATTR Value V= ( V(I_min_mag) + V(delta_I_mag)/2  ) * V(Don_2)
SYMATTR InstName B28
SYMBOL bv -672 -1632 R0
WINDOW 3 46 76 Left 2
WINDOW 0 47 54 Left 2
SYMATTR Value V= ( V(I_pk) - V(delta_I_mag)/2  ) * V(Doff_2)
SYMATTR InstName B29
SYMBOL bv 784 -1792 R0
WINDOW 3 42 76 Left 2
WINDOW 0 47 49 Left 2
SYMATTR Value V= V(I_pk) - V(delta_I_mag)
SYMATTR InstName B30
SYMBOL cap -1280 -2208 R0
WINDOW 0 61 21 Left 2
WINDOW 3 56 43 Left 2
SYMATTR InstName Cs1
SYMATTR Value { Cs }
SYMBOL ind -1120 -2192 R0
SYMATTR InstName L1
SYMATTR Value {L}
SYMATTR SpiceLine Rser=0.1u
SYMBOL bv -1648 -4432 R0
WINDOW 3 277 173 Right 2
WINDOW 0 -9 150 Left 2
SYMATTR Value V=  V(V_mag) - V(Ind_V)
SYMATTR InstName B5
SYMBOL res -1504 -4448 R90
WINDOW 0 -7 58 VBottom 2
WINDOW 3 32 58 VTop 2
SYMATTR InstName R11
SYMATTR Value {1 * R_lp}
SYMBOL cap -1488 -4400 R0
SYMATTR InstName C4
SYMATTR Value 10p
SYMBOL voltage -1456 -1296 R0
SYMATTR InstName V1
SYMATTR Value {Cs}
SYMBOL bv -1680 -1632 R0
WINDOW 0 49 36 Left 2
WINDOW 3 44 68 Left 2
SYMATTR InstName B4
SYMATTR Value V= limit( V(CCM_Ind_V), -1*V(V_demag) + 1m, (V(V_mag) - 1m) )
SYMBOL bv -1648 -4160 R0
WINDOW 3 314 181 Right 2
WINDOW 0 -8 152 Left 2
SYMATTR Value V=  V(V_demag) + V(Ind_V)
SYMATTR InstName B20
SYMBOL res -1504 -4176 R90
WINDOW 0 -7 58 VBottom 2
WINDOW 3 32 58 VTop 2
SYMATTR InstName R13
SYMATTR Value {R_lp}
SYMBOL cap -1488 -4128 R0
SYMATTR InstName C8
SYMATTR Value 10p
SYMBOL bv -1744 -2880 R0
WINDOW 3 51 65 Left 2
WINDOW 0 54 36 Left 2
SYMATTR Value V= limit( V(Don_0) + V(Doff_0), 0, 2)
SYMATTR InstName B7
SYMBOL bv -976 -2576 R0
WINDOW 3 53 148 Left 2
WINDOW 0 54 106 Left 2
SYMATTR Value V= if( sync > 0.5, 1, if( V(CCM_test) > 1,  V(tst1), V(tst2) )  )
SYMATTR InstName B13
SYMBOL bv -976 -2752 R0
WINDOW 3 62 77 Left 2
WINDOW 0 60 42 Left 2
SYMATTR Value V= if( V(CCM_raw) > 0.9, 1, 0 )
SYMATTR InstName B19
SYMBOL bv -448 -2768 R0
WINDOW 3 63 83 Left 2
WINDOW 0 68 49 Left 2
SYMATTR Value V= if( V(CCM_raw) < 0.1, 0, 1 )
SYMATTR InstName B27
SYMBOL res -688 -2592 R90
WINDOW 0 -3 55 VBottom 2
WINDOW 3 36 51 VTop 2
SYMATTR InstName R1
SYMATTR Value {10*R_lp}
SYMBOL cap -656 -2560 R0
WINDOW 0 38 10 Left 2
WINDOW 3 40 36 Left 2
SYMATTR InstName C5
SYMATTR Value 10p
SYMBOL bi -1664 -2096 R180
WINDOW 0 -92 38 Left 2
WINDOW 3 -47 15 Right 2
SYMATTR InstName B32
SYMATTR Value I = V(I_min_mag)
SYMBOL res -1280 -2160 R0
WINDOW 0 62 40 Left 2
WINDOW 3 59 73 Left 2
SYMATTR InstName Rs1
SYMATTR Value R = V(Rs)
SYMBOL bv -1664 -1856 R0
WINDOW 0 45 54 Left 2
WINDOW 3 239 84 Left 2
SYMATTR InstName B1
SYMATTR Value V= if( V(CCM) > 0.5, {Rs_CCM}, {Rs_DCM}  )
SYMBOL bv -1232 -1296 R0
WINDOW 0 45 54 Left 2
WINDOW 3 43 81 Left 2
SYMATTR InstName B2
SYMATTR Value V= V(Rs)
SYMBOL res -1488 -1872 R90
WINDOW 0 10 125 VBottom 2
WINDOW 3 -25 23 VTop 2
SYMATTR InstName R2
SYMATTR Value {100*R_lp}
SYMBOL cap -1488 -1840 R0
WINDOW 0 38 10 Left 2
WINDOW 3 40 36 Left 2
SYMATTR InstName C1
SYMATTR Value 10p
TEXT 96 -4344 Left 2 !.param R_lp = 0.1meg/Fs
TEXT 96 -4560 Left 2 !.param L = 10u
TEXT 96 -4592 Left 2 !.param Fs = 200k
TEXT 96 -4464 Left 2 !.param D_min = 0.05
TEXT 96 -4432 Left 2 !.param D_max = 0.90
TEXT 96 -4496 Left 2 !.param SlopeAmp =0.2
TEXT 96 -4528 Left 2 !.param Ri = 0.25
TEXT 96 -4624 Left 2 !.param sync = 0
TEXT 192 -1664 Left 2 ;Drawn : Mark Dimattina
TEXT 184 -1752 Left 4 ;Title : PWM-CM3
TEXT 192 -1600 Left 2 ;Rev: 0.02
TEXT 192 -1632 Left 2 ;Date:10/06/2024
TEXT 192 -1568 Left 2 ;M.J.Dimattina@ieee.org
TEXT -1520 -2008 Left 2 !.param Cs = { 1 / ( L * (pi * Fs)**2 ) }
TEXT -800 -4088 Left 2 ;Peak Current
TEXT -1888 -3840 Left 2 ;V = L di/dt
TEXT -1888 -3808 Left 2 ;dt = L * di / V
TEXT 960 -2008 Left 2 ;delta I   during demag
TEXT -680 -2176 Left 2 ;di =V * dt /  L
TEXT -496 -2120 Left 2 ;delta I   during mag
TEXT -648 -1928 Left 2 ;Magentizing Current
TEXT -640 -1680 Left 2 ;De-magentizing Current
TEXT -1936 -3608 Left 2 ;On Time Duty Cycle
TEXT -1936 -3392 Left 2 ;Off Time Duty Cycle
TEXT -1768 -2928 Left 2 ;When Don + Doff > 1
TEXT -1264 -3704 Left 2 ;Don_1 = Don_0 / ( Don_0 + Doff_0 )
TEXT -1256 -3656 Left 2 ;simplifies to ->
TEXT -1888 -3752 Left 5 ;DCM
TEXT -1176 -3760 Left 5 ;CCM
TEXT -264 -3776 Left 5 ;Mode Toggle
TEXT -1344 -3072 Left 5 ;Mode Selection
TEXT -712 -2256 Left 5 ;Current Calculation
TEXT -1672 -2344 Left 5 ;Induced Inductor Voltage
TEXT -928 -4536 Left 5 ;Peak Current
TEXT -928 -2976 Left 2 ;Hysteresis to improve transient simulation speed
TEXT -1736 -4528 Left 5 ;Inductor Voltage
TEXT -1736 -4584 Left 5 ;Mag / Demag
TEXT -1520 -1968 Left 2 !.param Rs_CCM = { sqrt( L / Cs ) / Q }
TEXT -1720 -1968 Left 2 !.param Q = 10
TEXT -1520 -1928 Left 2 !.param Rs_DCM = { sqrt( L / Cs ) / 0.5 }
RECTANGLE Normal 640 -1472 -2016 -4704 2

The netlist it stands for:
* BuckBoost_negInput.asc
R5 CM_p N007 1µ
R_L2 0 CM_a 10m
Vin_CM 0 N007 {Vin}
C2 CM_out N005 {Cbulk}
R6 N005 0 {Cesr}
R8 N003 CM_out 1µ
C4 CM_out 0 1n
R4 CM_in CM_Vi {Rdiv1}
R9 CM_Vi 0 {Rdiv2}
R10 CM_in N009 {Rspeed}
C6 N009 CM_Vi {Cspeed}
V3 CM_in CM_out 0 AC 1u
V2 Rload 0 PULSE({R_idle} {R_step} 0.5ms {loadRiseFall} {loadRiseFall} 1m 6m)
R2 CM_out 0 R = V(Rload)
XX2 CM_Vi CM_Vc transconerroramp params: C_comp = {TA_Ccomp}, R_comp = {TA_Rcomp}, Pos = {TA_Max}, Neg = {TA_Min}, Gain = {TA_Gain}, Vref = {Vref}
R1 a N006 1µ
L1 N001 c {L}
R_L1 0 N001 10m
Vin_CM1 0 N006 {Vin}
C1 out N004 {Cbulk}
R3 N004 0 {Cesr}
R7 N002 out 1µ
C3 out 0 1n
R11 out Vi {Rdiv1}
R12 Vi 0 {Rdiv2}
R13 out N008 {Rspeed}
C5 N008 Vi {Cspeed}
R14 out 0 R = V(Rload)
XX5 Vi Vc transconerroramp params: C_comp = {TA_Ccomp}, R_comp = {TA_Rcomp}, Pos = {TA_Max}, Neg = {TA_Min}, Gain = {TA_Gain}, Vref = {Vref}
XX3 Vc a c N002 idealboost params: Fs = {Fs}, Ri = {Rsense}, SlopeAmp = {SlopeAmp}, D_min = {D_lo}, D_max = {D_hi}
XX4 CM_Vc CM_a N003 CM_p boost_cm3 params: Fs = {Fs}, Ri = {Rsense}, L = {L}, SlopeAmp = {SlopeAmp}, D_min = {D_lo}, D_max = {D_hi}

* block symbol definitions
.subckt transconerroramp Vi Vc
G1 0 Vc ref_Av N002 { Gain }
V1 ref_Av 0 {Vref}
C1 Vc 0 {C_comp2}
C2 N003 0 {C_comp}
R1 Vc N003 {R_comp}
B1 Vc 0 I= if( V(Vc)  > {Pos}, {alpha} * ( V(Vc) -  {Pos} ), 0 )
B2 0 Vc I= if( V(Vc)  < {Neg}, {alpha} * (  {Neg} - V(Vc)  ), 0 )
R2 Vc 0 1000Meg
C3 N002 0 1p
R3 N002 N001 10k
E1 N001 0 Vi_lim 0 1
B3 Vi_lim 0 V= limit(  V(Vi), {Neg}, {Pos}  )
R4 Vi 0 10Meg
.param alpha = 5m
.param R_comp =1k
.param C_comp = 1n
.param C_comp2 = 1p
* B1
* B2
* Drawn : Mark Dimattina
* Title : Transconductance Error Amp
* Rev: 0.04
* Date: 25/07/2017
* M.J.Dimattina@ieee.org
.param Pos = 4
.param Neg = 0
.param Vref = 2.5
.param Gain = 135u
.ends transconerroramp

.subckt idealboost Vc a c p
H1 N001 0 V1 1
V1 c Sw 0
R5 I_sense N001 100
C2 I_sense 0 100p
A1 set trip_reset 0 0 0 q_bar q 0 SRFLOP
V2 set 0 PULSE(0 1 0 {Trise_fall} {Trise_fall} {Ton_min} {Period})
V3 reset 0 PULSE(0 1 {Ton_max} {Trise_fall} {Trise_fall} {Trise_fall} {Period} )
H2 N002 0 V5 1
R8 N003 N002 100
C5 N003 0 100n
V4 ramp 0 PULSE(0 {slopeAmp} 0 {Period - 2*Trise_fall} {Trise_fall} {Trise_fall} {Period})
B1 sense_slope 0 V={Ri}*V(I_sense) + V(ramp)
V5 Sw N004 0
R10 I_out N003 1000
C7 I_out 0 10n
A2 0 reset 0 trip2 0 0 trip_reset 0 OR
B2 N005 0 V=if( V(sense_slope) > V(Vc), 1, 0)
R11 trip N005 100
C8 trip 0 10p
B3 FET_R 0 V=if( V(q) > 0.5, {Rfet}, 1meg )
R2 N004 p R=V(Rdiode)
B4 Rdiode 0 V= if( V(Sw) > V(p), 10m, 100k )
B5 trip2 0 V=  V(trip) - V(set)
V6 On_time_ramp 0 PULSE(0 {1} 0 {Period - 2*Trise_fall} {Trise_fall} {Trise_fall} {Period})
B6 On_time 0 V=if( V(q) > 0.5, V(On_time_ramp), 0 )
R1 Sw a R = V(FET_R)
* TransconErrorAmp
.param Period = {1/Fs}
.param Trise_fall = 1n
.param Ton_min = {D_min * Period }
.param Ton_max = {D_max * Period}
.param Rfet = 1m
.param Fs = 100k
.param D_max = 90
.param D_min = 5
.param slopeAmp = 0.8
.param Ri = 0.25
* Drawn : Mark Dimattina
* Title : IdealBoost
* Rev: 0.04
* Date: 25/07/2017
* M.J.Dimattina@ieee.org
.ends idealboost

.subckt boost_cm3 Vc A C P
Bin A P I=  V(I_mag)
Bout A C I= V(I_demag)
XX1 Vc N001 N002 I_mag I_demag pwm_cm3 params: sync = {sync}, L = {L}, Fs = {Fs}, Ri = {Ri} , SlopeAmp = {SlopeAmp}, D_min = {D_min}, D_max = {D_max}
B1 N001 0 V= V(a, p)
B2 N002 0 V= V(c, a)
.param L = 10u
.param Fs = 200k
.param D_min = 0.05
.param D_max = 0.90
.param SlopeAmp =0.2
.param Ri = 0.25
.param sync = 0
* Drawn : Mark Dimattina
* Title : Boost CM3
* Rev: 0.01
* Date: 16/05/2024
* M.J.Dimattina@ieee.org
* Boost
.ends boost_cm3

.subckt pwm_cm3 Vc V_mag V_demag I_mag I_demag
R3 Vc 0 1G
B6 I_Pk_min 0 V=  V(mag) * {D_min / (Fs * L ) }
B10 I_pk 0 V=  max( V(I_pk_raw), V(I_pk_min)  )
B26 I_pk_raw 0 V=  ( V(Vc) - {SlopeAmp} * V(don_2) ) / {Ri}
B21 Don_0 0 V = {Fs * L} * V(I_pk) / V(mag)
B11 Doff_0 0 V = {Fs * L} * V(I_pk) / (V(demag) + 1u)
B12 N005 0 V= if (  V(CCM_test)  > 1 , 1, 0  )
R7 CCM_raw N005 {100*R_lp}
C2 CCM_raw 0 10p
B14 Don_1 0 V= limit( V(demag) / ( V(mag) + V(demag)  ), {D_min}, {D_max} )
B15 Doff_1 0 V=  1- V(Don_1)
B16 N003 0 V= limit(  min( V(Don_1), V(Don_0)  ),  {D_min}, {D_max} )
R17 Don_2 N003 {1*R_lp}
C10 Don_2 0 10p
B18 N004 0 V = min (  V(Doff_1), V(Doff_0)  )
R18 Doff_2 N004 {1*R_lp}
C11 Doff_2 0 10p
B23 delta_I_demag 0 V= V(demag) * V(Doff_2) / {L * Fs}
B24 I_min_mag 0 V= V(I_pk) - V(delta_I_mag)
B25 delta_I_mag 0 V= V(mag) * V(Don_2) / {L * Fs}
B28 I_mag 0 V= ( V(I_min_mag) + V(delta_I_mag)/2  ) * V(Don_2)
B29 I_demag 0 V= ( V(I_pk) - V(delta_I_mag)/2  ) * V(Doff_2)
B30 I_min_demag 0 V= V(I_pk) - V(delta_I_mag)
Cs1 CCM_Ind_V P001 { Cs }
L1 CCM_Ind_V 0 {L} Rser=0.1u
B5 N001 0 V=  V(V_mag) - V(Ind_V)
R11 mag N001 {1 * R_lp}
C4 mag 0 10p
V1 N008 0 {Cs}
B4 Ind_V 0 V= limit( V(CCM_Ind_V), -1*V(V_demag) + 1m, (V(V_mag) - 1m) )
B20 N002 0 V=  V(V_demag) + V(Ind_V)
R13 demag N002 {R_lp}
C8 demag 0 10p
B7 CCM_test 0 V= limit( V(Don_0) + V(Doff_0), 0, 2)
B13 N006 0 V= if( sync > 0.5, 1, if( V(CCM_test) > 1,  V(tst1), V(tst2) )  )
B19 tst1 0 V= if( V(CCM_raw) > 0.9, 1, 0 )
B27 tst2 0 V= if( V(CCM_raw) < 0.1, 0, 1 )
R1 CCM N006 {10*R_lp}
C5 CCM 0 10p
B32 0 CCM_Ind_V I = V(I_min_mag)
Rs1 P001 0 R = V(Rs)
B1 N007 0 V= if( V(CCM) > 0.5, {Rs_CCM}, {Rs_DCM}  )
B2 N009 0 V= V(Rs)
R2 Rs N007 {100*R_lp}
C1 Rs 0 10p
.param R_lp = 0.1meg/Fs
.param L = 10u
.param Fs = 200k
.param D_min = 0.05
.param D_max = 0.90
.param SlopeAmp =0.2
.param Ri = 0.25
.param sync = 0
* Drawn : Mark Dimattina
* Title : PWM-CM3
* Rev: 0.02
* Date:10/06/2024
* M.J.Dimattina@ieee.org
.param Cs = { 1 / ( L * (pi * Fs)**2 ) }
* Peak Current
* V = L di/dt
* dt = L * di / V
* delta I   during demag
* di =V * dt /  L
* delta I   during mag
* Magentizing Current
* De-magentizing Current
* On Time Duty Cycle
* Off Time Duty Cycle
* When Don + Doff > 1
* Don_1 = Don_0 / ( Don_0 + Doff_0 )
* simplifies to ->
* DCM
* CCM
* Mode Toggle
* Mode Selection
* Current Calculation
* Induced Inductor Voltage
* Peak Current
* Hysteresis to improve transient simulation speed
* Inductor Voltage
* Mag / Demag
.param Rs_CCM = { sqrt( L / Cs ) / Q }
.param Q = 10
.param Rs_DCM = { sqrt( L / Cs ) / 0.5 }
.ends pwm_cm3

.ac oct 100 10 10meg
.param L = 30u
.param Fs = 100k
.param D_lo = {80n * Fs}
.param D_hi = 0.9
.param SlopeAmp = 0.8m
* Duty Cycle Limits
* IC Parameters
.param Vout = 6
.param Cbulk = {100u}
.param Cesr = 1m
.param Vin = 5
.param Lesr = 10m
.param Rsense = 250m
.param Rdiv2 = 10k
.param Rdiv1 = Rdiv2 * (Vout - Vref) / Vref
.param Vref = 1.24
* TA Parameters
.param TA_Rcomp = 30k
.param TA_Ccomp = 2n
.param TA_Ccomp2 = 1p
.param TA_Gain = 135u
.param TA_Max = 2.4
.param TA_Min = 1m
.param I_step = 30mA
.param I_idle = 500m
.param R_idle = Vout / I_idle
.param loadRiseFall = 1u
.param Rspeed = 10meg
.param Cspeed = 1p
.param Vc = 390m
* Circuit Parameters
.param R_step = Vout / I_step
.ic V(out) = {Vout}
.ic V(Vi) = {Vref}
* Load Parameters
.ic V(Vc) = Vc
.ic I(L1) = {I_idle}
* Drawn : Mark Dimattina
* Title : BuckBoost_negInput
* Rev: 0.01
* Date: 02/09/2017
* M.J.Dimattina@ieee.org
* .tran 0 6m 0
.ic V(c) = -10m
.step param Vout 4 6 2
.backanno
.end